# Altium schematic sheet Sheet6.SchDoc
size A4; SheetNumber: 5; SheetTotal: 5
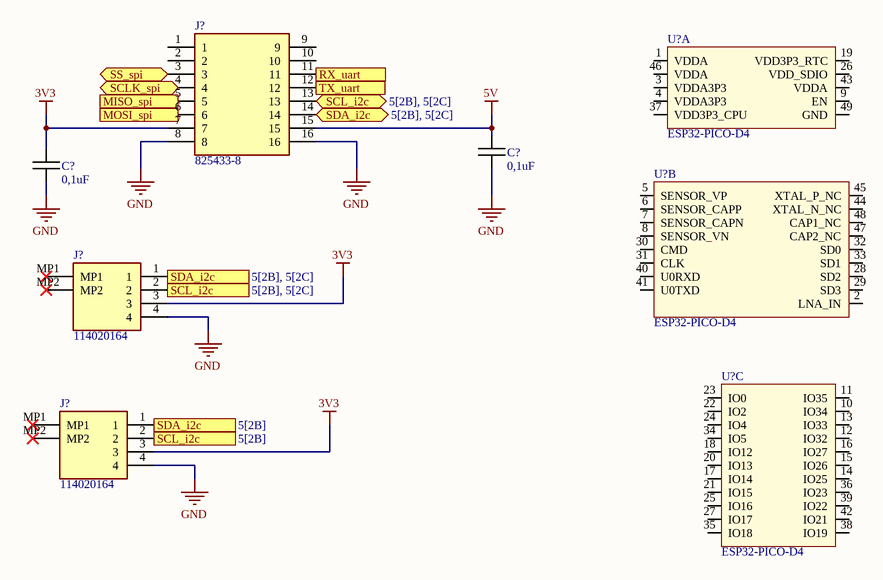
[diagram p0: Sheet6.SchDoc]

## Parts
(Parts that share a designator on the sheet are numbered #1, #2 ... from top to bottom, then left to right.)
C?#1  0,1uF  [CAPC1005X06N]
C?#2  0,1uF  [CAPC1005X06N]
J?#1  825433-8
J?#2  114020164  [114020164]
J?#3  114020164  [114020164]
U?#1  ESP32-PICO-D4  [PQFN50P700X700X104_HS-49N]  (part A of 3)
U?#2  ESP32-PICO-D4  [PQFN50P700X700X104_HS-49N]  (part B of 3)
U?#3  ESP32-PICO-D4  [PQFN50P700X700X104_HS-49N]  (part C of 3)

## Ports
MISO_spi (in), MOSI_spi (out), RX_uart (in), SCL_i2c (bidir, see 5[2B], 5[2C]), SCL_i2c (in, see 5[2B]), SCL_i2c (in, see 5[2B], 5[2C]), SCLK_spi (bidir), SDA_i2c (bidir, see 5[2B], 5[2C]), SDA_i2c (out, see 5[2B]), SDA_i2c (out, see 5[2B], 5[2C]), SS_spi (bidir), TX_uart (out)

## Nets
3V3: C?#2.1 J?#1.7 J?#2.3 J?#3.3
5V: C?#1.1 J?#1.15
GND: C?#1.2 C?#2.2 J?#1.8 J?#1.16 J?#2.4 J?#3.4
RX_uart: J?#1.11 ; port RX_uart
SCL_i2c: J?#1.13 J?#2.2 J?#3.2 ; port SCL_i2c
SDA_i2c: J?#1.14 J?#2.1 J?#3.1 ; port SDA_i2c
SS_spi: J?#1.3 ; port SS_spi
TX_uart: J?#1.12 ; port TX_uart

Not connected (* = marked no-connect by the designer): J?#1 1 2 4 5 6 9 10; J?#2 MP1* MP2*; J?#3 MP1* MP2*; U?#1 1(VDDA) 3(VDDA3P3) 4(VDDA3P3) 9(EN) 19(VDD3P3_RTC) 26(VDD_SDIO) 37(VDD3P3_CPU) 43(VDDA) 46(VDDA) 49(GND); U?#2 2(LNA_IN) 5(SENSOR_VP) 6(SENSOR_CAPP) 7(SENSOR_CAPN) 8(SENSOR_VN) 28(SD2) 29(SD3) 30(CMD) 31(CLK) 32(SD0) 33(SD1) 40(U0RXD) 41(U0TXD) 44(XTAL_N_NC) 45(XTAL_P_NC) 47(CAP2_NC) 48(CAP1_NC); U?#3 10(IO34) 11(IO35) 12(IO32) 13(IO33) 14(IO25) 15(IO26) 16(IO27) 17(IO14) 18(IO12) 20(IO13) 21(IO15) 22(IO2) 23(IO0) 24(IO4) 25(IO16) 27(IO17) 34(IO5) 35(IO18) 36(IO23) 38(IO19) 39(IO22) 42(IO21)

## Library data of the parts
C?#1 C?#2 = Capacitor
J?#1 = Connect-Mikronus: Headers & Wire Housings 8P double for connection mikrobus; Manufacturer_Name: TE Connectivity; Manufacturer_Part_Number: 825433-8; Mouser Part Number: 571-825433-8
J?#2 J?#3 = 114020164: Seeed Studio Accessories Grove Female Header - SMD-4P-2.0mm-90D-20Pcs; Manufacturer_Name: Seeed Studio; Manufacturer_Part_Number: 114020164; Mouser Part Number: 713-114020164
U?#1-U?#3 = ESP32: Système RF sur puce - SoC SIP module ESP32 with 4MByte Flash, Dual Core MCU, Wi-Fi & Bluetooth Combo, LGA48-pin, 7*7mm; Manufacturer 1: Espressif Systems; Supplier 1: Digi-Key; Supplier Part Number 1: 1904-1029-1-ND; Manufacturer Part Number 1: ESP32-PICO-D4